# EAGLE schematic SmartGarden Remote v1.5 (EAGLE 6.5.0)
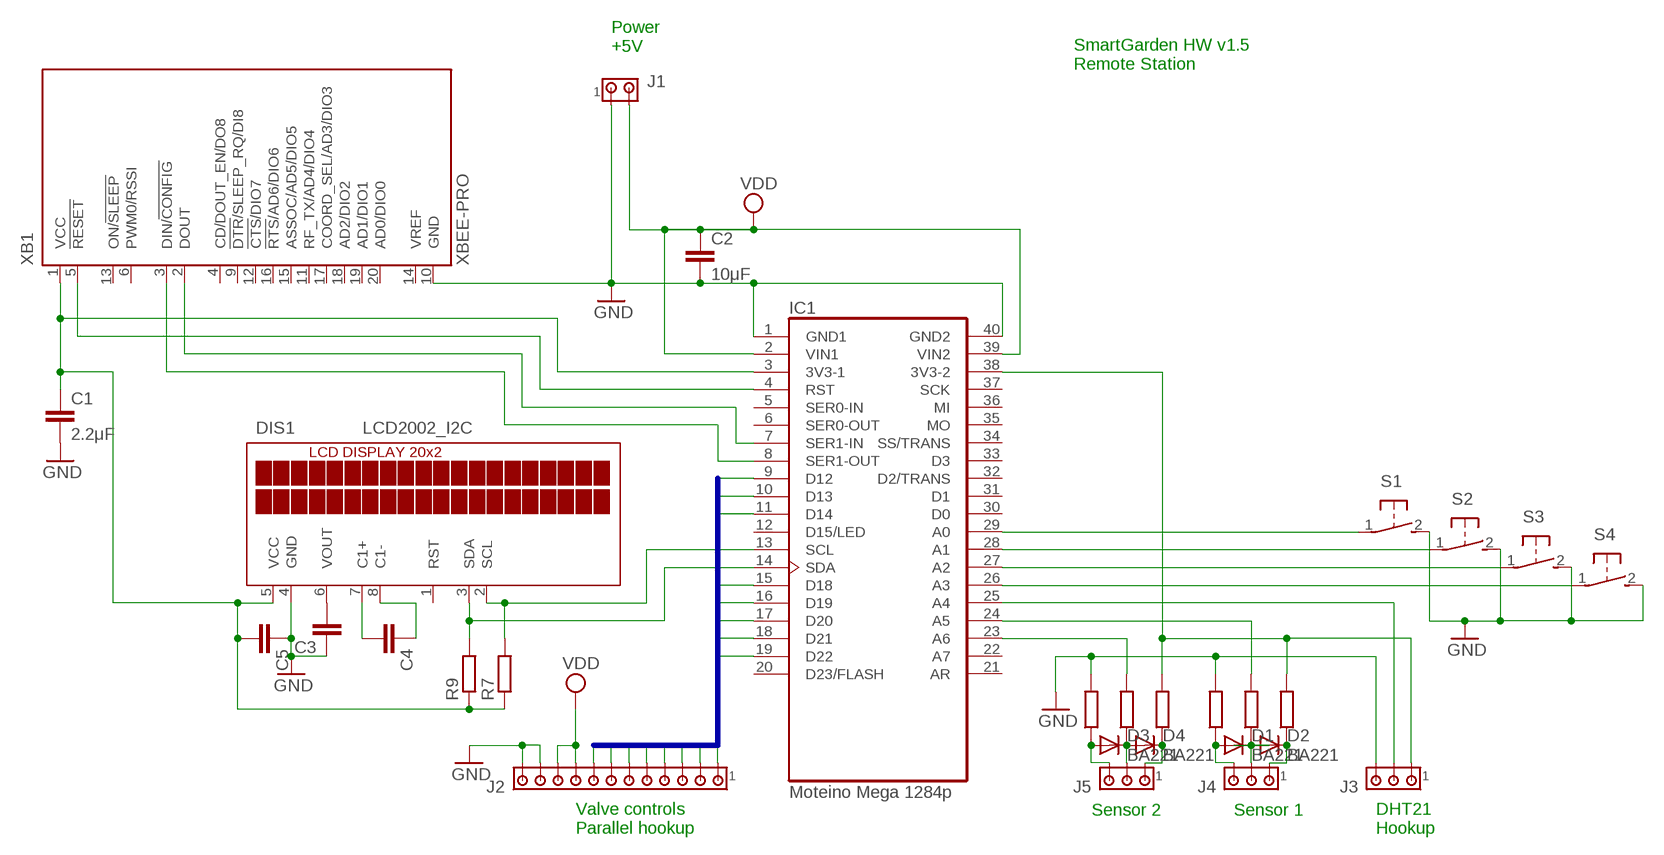
[diagram p0: schematic, sheet 1]

## Parts
C1  2.2μF  C-EU050-055X075  [C050-055X075]
C2  10μF  C-EU050-035X075  [C050-035X075]
C3  C2.5/2  [C2.5-2]
C4  C2.5/2  [C2.5-2]
C5  C2.5/2  [C2.5-2]
D1  BA221  [DO35-10]
D2  BA221  [DO35-10]
D3  BA221  [DO35-10]
D4  BA221  [DO35-10]
DIS1  LCD2002_I2C  [LCD2002_I2C]
IC1  Moteino Mega 1284p  MOTEINO_MEGA  [DIL40]
J1  MTA02-156  [1X2MTA]
J2  MTA12-156  [1X12MTA]
J3  MTA03-156  [1X3MTA]
J4  MTA03-156  [1X3MTA]
J5  MTA03-156  [1X3MTA]
R7  R-EU_0207/10  [0207/10]
R9  R-EU_0207/10  [0207/10]
S1  31-XX  [B3F-31XX]
S2  31-XX  [B3F-31XX]
S3  31-XX  [B3F-31XX]
S4  31-XX  [B3F-31XX]
XB1  XBEE-PRO  [XBEE-PRO]

## Nets
GND: C1.2 C2.2 C3.1 C5.1 DIS1.4(GND) IC1.1(GND1) IC1.40(GND2) J1.1 J2.11 J2.12 J3.3 S1.2(S) S2.2(S) S3.2(S) S4.2(S) XB1.10(GND)
N$1: DIS1.2(SCL) IC1.13(SCL) R7.2
N$2: C1.1 C5.2 DIS1.5(VCC) IC1.3(3V3-1) R7.1 R9.1 XB1.1(VCC)
N$3: IC1.4(RST) XB1.5(!RESET)
N$4: IC1.8(SER1-OUT) XB1.3(DIN/!CONFIG)
N$5: D3.C D4.A J5.2
N$6: DIS1.3(SDA) IC1.14(SDA) R9.2
N$7: C4.2 DIS1.7(C1+)
N$8: C4.1 DIS1.8(C1-)
N$9: C3.2 DIS1.6(VOUT)
N$13: IC1.29(A0) S1.1(P)
N$14: IC1.28(A1) S2.1(P)
N$15: IC1.27(A2) S3.1(P)
N$16: IC1.26(A3) S4.1(P)
N$17: IC1.24(A5)
N$18: IC1.23(A6)
N$19: IC1.7(SER1-IN) XB1.2(DOUT)
N$28: D1.C D2.A J4.2
N$29: D1.A J4.3
N$30: D2.C J4.1
N$31: D3.A J5.3
N$32: D4.C J5.1
N$33: IC1.25(A4) J3.2
N$34: IC1.38(3V3-2) J3.1
VALVE_OUT0: IC1.9(D12) J2.1
VALVE_OUT1: IC1.10(D13) J2.2
VALVE_OUT2: IC1.11(D14) J2.3
VALVE_OUT3: IC1.15(D18) J2.4
VALVE_OUT4: IC1.16(D19) J2.5
VALVE_OUT5: IC1.17(D20) J2.6
VALVE_OUT6: IC1.18(D21) J2.7
VALVE_OUT7: IC1.19(D22) J2.8
VDD: C2.1 IC1.2(VIN1) IC1.39(VIN2) J1.2 J2.9 J2.10
Unconnected: DIS1.1(RST) IC1.5(SER0-IN) IC1.6(SER0-OUT) IC1.12(D15/LED) IC1.20(D23/FLASH) IC1.21(AR) IC1.22(A7) IC1.30(D0) IC1.31(D1) IC1.32(D2/TRANS) IC1.33(D3) IC1.34(SS/TRANS) IC1.35(MO) IC1.36(MI) IC1.37(SCK) XB1.4(CD/DOUT_EN/DO8) XB1.6(PWM0/RSSI) XB1.9(!DTR!/SLEEP_RQ/DI8) XB1.11(RF_TX/AD4/DIO4) XB1.12(!CTS!/DIO7) XB1.13(ON/!SLEEP) XB1.14(VREF) XB1.15(ASSOC/AD5/DIO5) XB1.16(!RTS!/AD6/DIO6) XB1.17(COORD_SEL/AD3/DIO3) XB1.18(AD2/DIO2) XB1.19(AD1/DIO1) XB1.20(AD0/DIO0)

## Buses
VALVE_OUT[0..7]

## Notes on the sheet
- Power
  +5V
- SmartGarden HW v1.5
  Remote Station
- Sensor 2 | Sensor 1
- Valve controls
  Parallel hookup
- DHT21
  Hookup

## Library data of the parts
C1 C2 = resistor:C-EU: CAPACITOR, European symbol
C3-C5 = capacitor-wima:C: CAPACITOR naming: grid - package width
D1-D4 = diode:BA221: DIODE high speed (Philips)
DIS1 = SmartGarden:LCD2002_I2C: LCD display 20x2 characters with I2C interface, 3.3V NHD C0220BiZ FS(RGB); OC_FARNELL: unknown; OC_NEWARK: unknown
IC1 = SmartGarden:MOTEINO_MEGA: Moteino Mega
J1 = con-amp:MTA02-156: AMP connector
J2 = con-amp:MTA12-156: AMP connector
J3-J5 = con-amp:MTA03-156: AMP connector
R7 R9 = resistor:R-EU_: RESISTOR, European symbol
S1-S4 = switch-omron:31-XX: OMRON SWITCH; MPN: B3F-3100; OC_FARNELL: 959704; OC_NEWARK: 36M3582
XB1 = maxstream:XBEE: XBee (TM) /XBee-PRO(TM) OEM RF Modules Source: MaxStream, Inc. xbee_productmanual.pdf; MPN: XBP24-AWI-001; OC_FARNELL: 1337916; OC_NEWARK: 42M2667